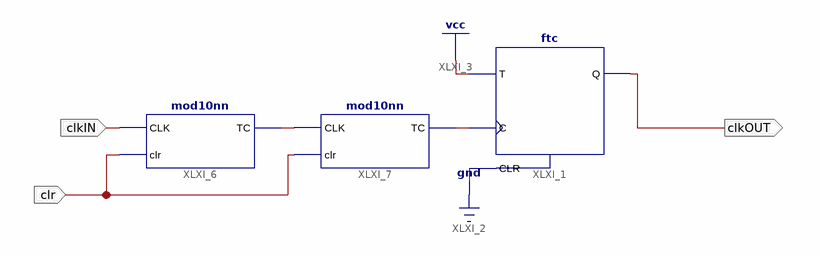
[diagram p0: schematic sheet 1]
// Xilinx ISE schematic Div200nn.sch (spartan6) as structural Verilog: 3 symbols, 3 ports
module Div200nn (
  input  clkIN,
  input  clr,
  output clkOUT
);

  wire XLXN_1, XLXN_2;

  ftc XLXI_1 (.C(XLXN_2), .CLR(1'b0), .T(1'b1), .Q(clkOUT));
  mod10nn XLXI_6 (.CLK(clkIN), .clr(clr), .TC(XLXN_1));
  mod10nn XLXI_7 (.CLK(XLXN_1), .clr(clr), .TC(XLXN_2));
endmodule
